# EAGLE design HC-base_revA (EAGLE 7.3.0)
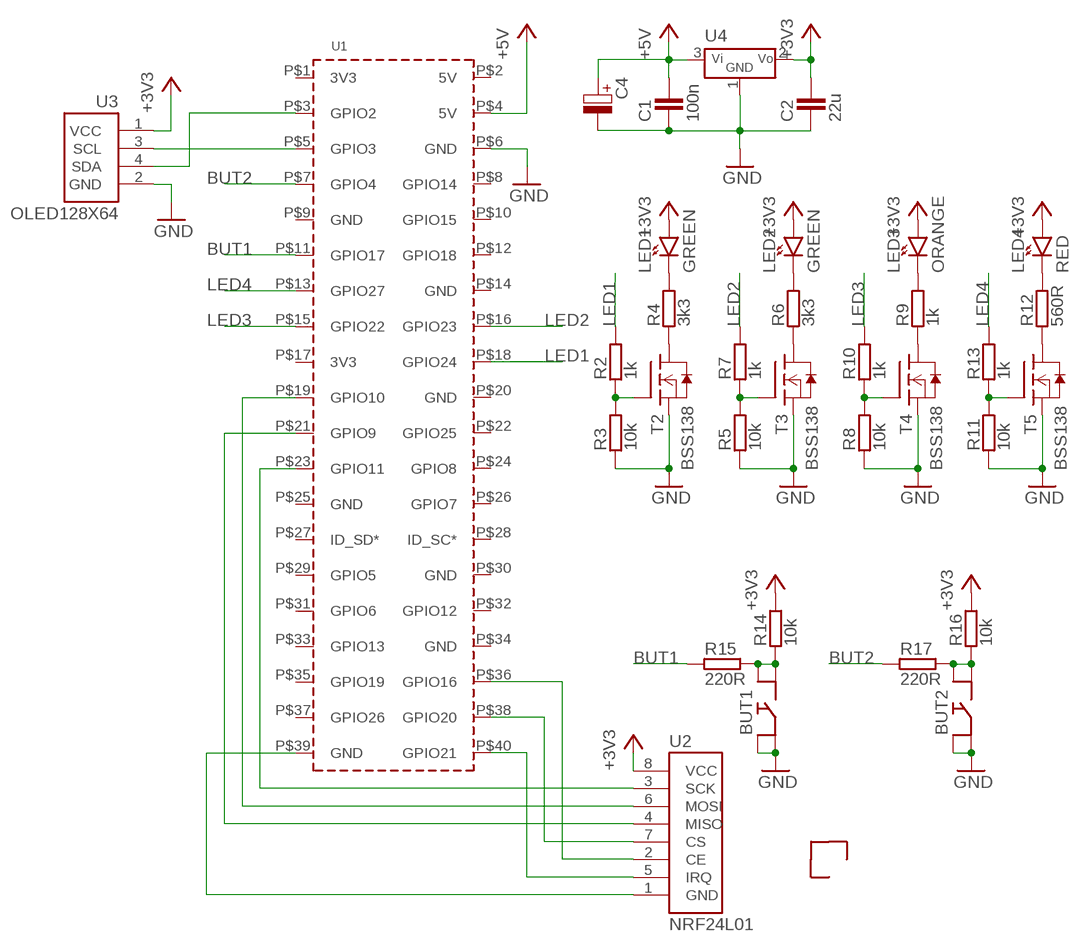
[diagram p0: schematic, sheet 1]

## Parts
BUT1  BUTTON'SMD'  [BUTTON_SMD]
BUT2  BUTTON'SMD'  [BUTTON_SMD]
C1  100n  C-CERAMIC'SMD'  [C0805]
C2  22u  C-CERAMIC'SMD'  [C0805]
C4  C-POLY'6.5MM'  [ELYT-6MM5]
LED1  GREEN  LED'SMD'  [LED0805]
LED2  GREEN  LED'SMD'  [LED0805]
LED3  ORANGE  LED'SMD'  [LED0805]
LED4  RED  LED'SMD'  [LED0805]
R2  1k  R'2'  [R0805]
R3  10k  R'2'  [R0805]
R4  3k3  R'2'  [R0805]
R5  10k  R'2'  [R0805]
R6  3k3  R'2'  [R0805]
R7  1k  R'2'  [R0805]
R8  10k  R'2'  [R0805]
R9  1k  R'2'  [R0805]
R10  1k  R'2'  [R0805]
R11  10k  R'2'  [R0805]
R12  560R  R'2'  [R0805]
R13  1k  R'2'  [R0805]
R14  10k  R'2'  [R0805]
R15  220R  R'2'  [R0805]
R16  10k  R'2'  [R0805]
R17  220R  R'2'  [R0805]
T2  BSS138  [SOT23]
T3  BSS138  [SOT23]
T4  BSS138  [SOT23]
T5  BSS138  [SOT23]
U1  RPI3_SIMPLE'PART'  [RPI3-PART]
U2  NRF24L01  [NRF24L01]
U3  OLED128X64  [OLED128X64]
U4  V_STAB'TS1117'  [SOT223]
U$1  CORNER  [CORNER]
U$2  CORNER  [CORNER]
U$3  CORNER  [CORNER]

## Nets
+3V3: C2.2 LED1.1(A) LED2.1(A) LED3.1(A) LED4.1(A) R14.2 R16.2 U2.8(VCC) U3.1(VCC) U4.2(VOUT)
+5V: C1.2 C4.+(POS) U1.P$4(5V) U4.3(VIN)
BUT1: R15.1 U1.P$11(GPIO17)
BUT2: R17.1 U1.P$7(GPIO4)
GND: BUT1.1 BUT1.2 BUT2.1 BUT2.2 C1.1 C2.1 C4.-(NEG) R3.1 R5.1 R8.1 R11.1 T2.2(S) T3.2(S) T4.2(S) T5.2(S) U1.P$6(GND) U3.2(GND) U4.1(GND)
LED1: R2.2 U1.P$18(GPIO24)
LED2: R7.2 U1.P$16(GPIO23)
LED3: R10.2 U1.P$15(GPIO22)
LED4: R13.2 U1.P$13(GPIO27)
N$1: R2.1 R3.2 T2.1(G)
N$2: U1.P$23(GPIO11) U2.3(SCK)
N$3: U1.P$19(GPIO10) U2.6(MOSI)
N$4: U1.P$21(GPIO9) U2.4(MISO)
N$5: U1.P$38(GPIO20) U2.7(CS)
N$6: U1.P$36(GPIO16) U2.2(CE)
N$7: U1.P$40(GPIO21) U2.5(IRQ)
N$8: U1.P$3(GPIO2) U3.4(SDA)
N$9: U1.P$5(GPIO3) U3.3(SCL)
N$10: R4.1 T2.3(D)
N$11: R6.1 T3.3(D)
N$12: R9.1 T4.3(D)
N$13: R12.1 T5.3(D)
N$14: R5.2 R7.1 T3.1(G)
N$15: LED1.2(K) R4.2
N$16: LED2.2(K) R6.2
N$17: R8.2 R10.1 T4.1(G)
N$18: LED3.2(K) R9.2
N$19: LED4.2(K) R12.2
N$20: R11.2 R13.1 T5.1(G)
N$21: U1.P$39(GND) U2.1(GND)
N$22: BUT1.3 BUT1.4 R14.1 R15.2
N$24: BUT2.3 BUT2.4 R16.1 R17.2
Unconnected: U1.P$1(3V3) U1.P$2(5V) U1.P$8(GPIO14) U1.P$9(GND) U1.P$10(GPIO15) U1.P$12(GPIO18) U1.P$14(GND) U1.P$17(3V3) U1.P$20(GND) U1.P$22(GPIO25) U1.P$24(GPIO8) U1.P$25(GND) U1.P$26(GPIO7) U1.P$27(ID_SD*) U1.P$28(ID_SC*) U1.P$29(GPIO5) U1.P$30(GND) U1.P$31(GPIO6) U1.P$32(GPIO12) U1.P$33(GPIO13) U1.P$34(GND) U1.P$35(GPIO19) U1.P$37(GPIO26)

## Library data of the parts
BUT1 BUT2 = 1_domaci:BUTTON
C1 C2 = 1_domaci:C-CERAMIC
C4 = 1_domaci:C-POLY
LED1-LED4 = 1_domaci:LED
R2-R17 = 1_domaci:R
T2-T5 = 1_domaci:BSS138
U1 = 1_domaci:RPI3_SIMPLE: Device for Raspberry Pi 3 board created by Dave Young for www.element14.com More information and support community is available at https://www.element14.com/community/community/raspberry-pi
U2 = 1_domaci:NRF24L01
U3 = 1_domaci:OLED128X64
U4 = 1_domaci:V_STAB
U$1-U$3 = 1_domaci:CORNER

## Board
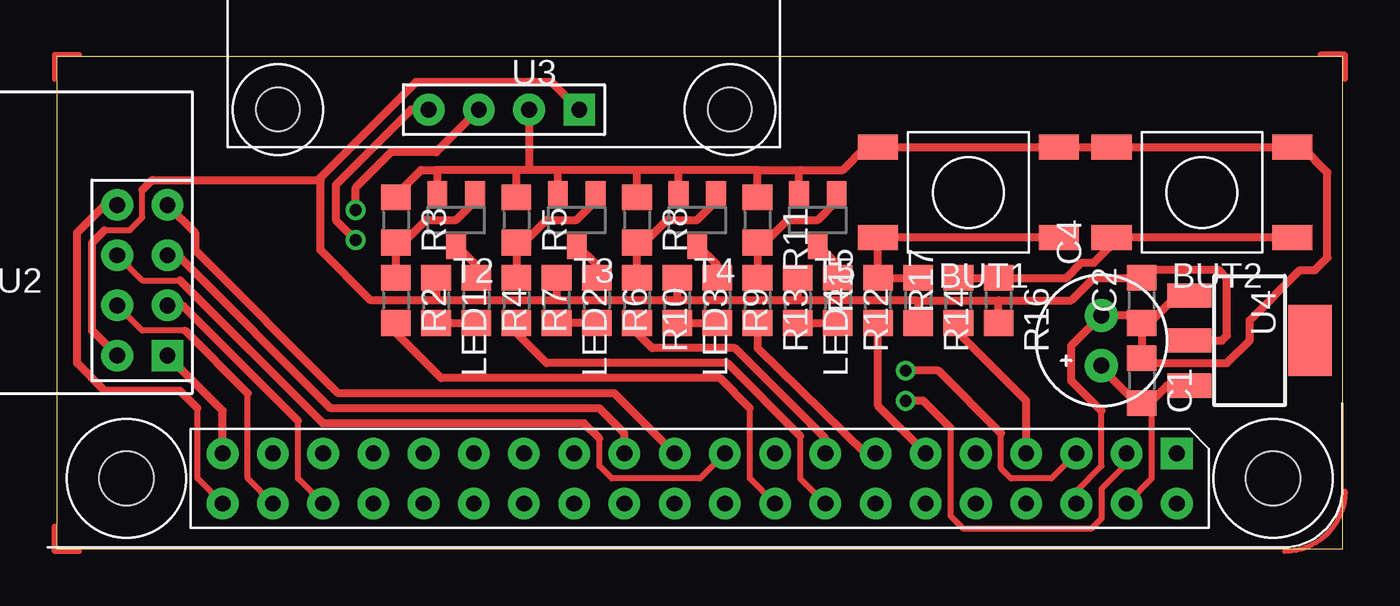
[diagram p1: board, top side]
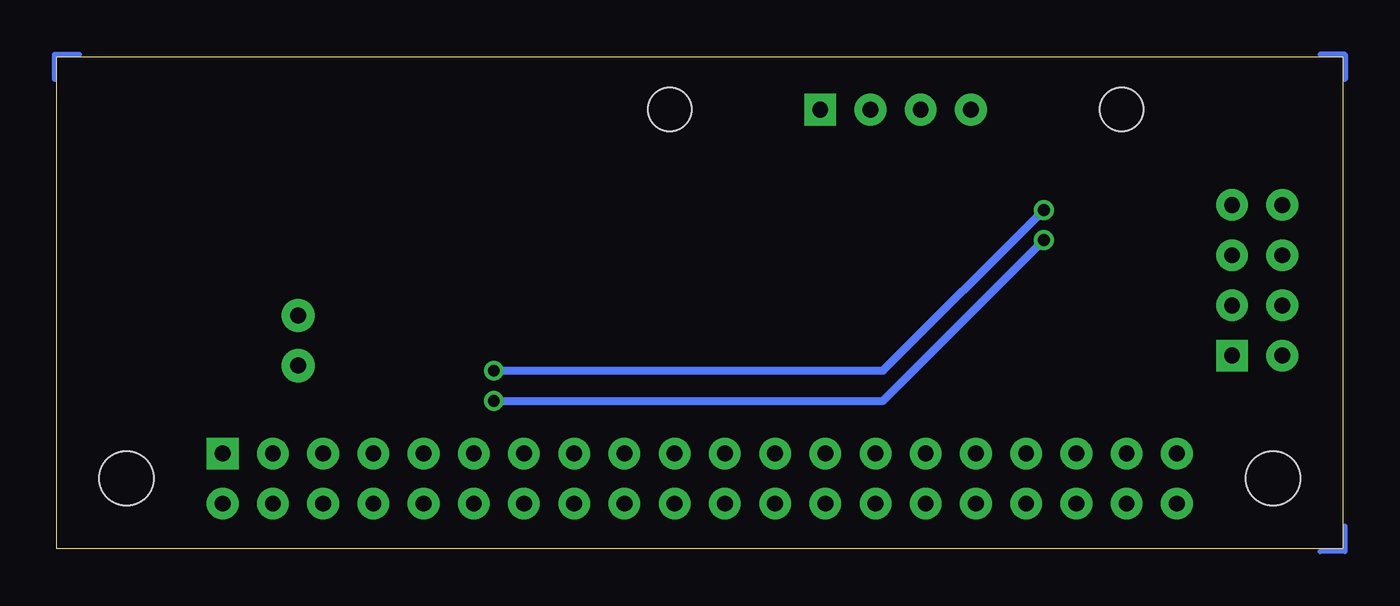
[diagram p2: board, bottom side, seen from below]

Size 65.02 x 24.89 mm. Coordinates in mm from the lower left corner, seen from the top.
Outline: 0,0 65.02,0 65.02,24.89 0,24.89 0,0
Copper layers (1*16): Top 0.035mm / dielectric 1.5mm / Bottom 0.035mm
Design rules "default *": minimum track width 10mil, minimum drill 24mil, track to track 8mil, track to pad 8mil, pad to pad 8mil, via to via 8mil, smd to smd 8mil, copper to edge 40mil, drill to drill 8mil, minimum pad ring 10mil, minimum via ring 8mil, stop-mask expansion 4mil, vias tented up to drill 0mil, thermal gap 10mil

### Footprints (pad centres in the part's own frame; a part is rotated, then mirrored left to right if it is on the bottom)
BUTTON_SMD = smd 2.032 x 1.27: 1 -4.572,-2.286; 2 4.572,-2.286; 3 4.572,2.286; 4 -4.572,2.286
C0805 = smd 1.3 x 1.5: 1 -1.143,0; 2 1.143,0
ELYT-6MM5 = drill 0.813 pad 1.676: + -1.27,0; - 1.27,0
LED0805 = smd 1.3 x 1.5: 1 -1.143,0; 2 1.143,0
R0805 = smd 1.3 x 1.5: 1 -1.143,0; 2 1.143,0
SOT23 = smd 1 x 1.4: 1 -0.953,-1.27; 2 0.953,-1.27; 3 0,1.27
RPI3-PART = drill 0.8 square: P$1 -24.13,-1.27 | drill 0.8: P$2 -24.13,1.27; P$3 -21.59,-1.27; P$4 -21.59,1.27; P$5 -19.05,-1.27; P$6 -19.05,1.27; P$7 -16.51,-1.27; P$8 -16.51,1.27; P$9 -13.97,-1.27; P$10 -13.97,1.27; P$11 -11.43,-1.27; P$12 -11.43,1.27; P$13 -8.89,-1.27; P$14 -8.89,1.27; P$15 -6.35,-1.27; P$16 -6.35,1.27; P$17 -3.81,-1.27; P$18 -3.81,1.27; P$19 -1.27,-1.27; P$20 -1.27,1.27; P$21 1.27,-1.27; P$22 1.27,1.27; P$23 3.81,-1.27; P$24 3.81,1.27; P$25 6.35,-1.27; P$26 6.35,1.27; P$27 8.89,-1.27; P$28 8.89,1.27; P$29 11.43,-1.27; P$30 11.43,1.27; P$31 13.97,-1.27; P$32 13.97,1.27; P$33 16.51,-1.27; P$34 16.51,1.27; P$35 19.05,-1.27; P$36 19.05,1.27; P$37 21.59,-1.27; P$38 21.59,1.27; P$39 24.13,-1.27; P$40 24.13,1.27 | hole 2.75: -28.999,-0.013; 29.001,-0.013
NRF24L01 = drill 0.8 square: 1 -1.27,5.08 | drill 0.8: 2 -1.27,2.54; 3 -1.27,0; 4 -1.27,-2.54; 5 1.27,-2.54; 6 1.27,0; 7 1.27,2.54; 8 1.27,5.08
OLED128X64 = drill 0.8 square: 1 -3.81,0 | drill 0.8: 2 -1.27,0; 3 1.27,0; 4 3.81,0 | hole 2.2: -11.43,0; 11.43,0
SOT223 = smd 1.219 x 2.235: 1 -2.286,-3.048; 2 0,-3.048; 3 2.286,-3.048 | smd 3.6 x 2.2: 4 0,3.048

### Placement (x,y rotation side)
BUT1  46.1,18.03 180 top
BUT2  57.91,18.03 180 top
C1  54.86,8.51 270 top
C2  54.86,12.57 90 top
C4  52.83,10.54 90 top
LED1  19.18,12.57 270 top
LED2  25.27,12.57 270 top
LED3  31.37,12.57 270 top
LED4  37.47,12.57 270 top
R2  17.14,12.57 270 top
R3  17.14,16.64 270 top
R4  21.21,12.57 270 top
R5  23.24,16.64 270 top
R6  27.31,12.57 270 top
R7  23.24,12.57 270 top
R8  29.34,16.64 270 top
R9  33.4,12.57 270 top
R10  29.34,12.57 270 top
R11  35.43,16.64 270 top
R12  39.5,12.57 270 top
R13  35.43,12.57 270 top
R14  43.56,12.57 270 top
R15  41.53,12.57 90 top
R16  47.62,12.57 270 top
R17  45.59,12.57 90 top
T2  20.19,16.64 180 top
T3  26.29,16.64 180 top
T4  32.39,16.64 180 top
T5  38.48,16.64 180 top
U1  32.51,3.56 180 top
U2  4.32,14.86 180 top
U3  22.61,22.22 180 top
U4  60.33,10.54 270 top
U$1  0.51,0.51 0 top
U$2  64.52,24.38 180 top
U$3  0.51,24.38 270 top

### Tracks (layer width: path | path; a pad name or v marks a point on that pad's centre or on a via)
+3V3
  Top 0.305: 2.41,16.13 3.68,16.13 4.32,16.76 4.32,18.16
  Top 0.406: U4.2 58.93,10.54 59.18,10.79 59.18,13.72 58.8,14.1 55.25,14.1 C2.2 52.45,13.72 51.31,12.57 47.62,12.57 | 43.43,12.57 47.62,12.57 | R16.2 47.62,12.57 | R14.2 43.56,12.45 43.43,12.57 | U2.8 1.78,11.05 1.78,15.49 2.41,16.13 | 4.32,18.16 4.83,18.67 13.34,18.67 | 43.43,12.57 37.47,12.57 | 37.47,12.57 31.37,12.57 | 31.37,12.57 25.27,12.57 | 25.27,12.57 19.18,12.57 | LED4.1 37.47,12.57 | LED3.1 31.37,12.57 | LED2.1 25.27,12.57 | LED1.1 19.18,12.57 | U3.1 25.02,23.62 18.16,23.62 13.34,18.8 13.34,18.67 | 19.18,12.57 15.88,12.57 13.34,15.11 13.34,18.67
+5V
  Top 0.305: U1.P$4 55.37,3.56 55.37,6.86
  Top 0.406: C1.2 55.25,7.37 56.13,8.25 U4.3 | C1.2 54.61,7.37 52.83,9.14 C4.+ | 55.37,6.86 C1.2
BUT1
  Top 0.406: U1.P$11 41.53,7.24 R15.1
BUT2
  Top 0.406: U1.P$7 49.02,7.49 45.59,10.92 R17.1
GND
  Top 0.305: U1.P$6 51.56,2.92 52.83,4.19 52.83,6.98
  Top 0.406: C2.1 55.25,11.43 56.64,12.83 U4.1 | C2.1 C1.1 55.25,9.65 55.5,9.4 59.18,9.4 60.33,10.54 60.33,11.56 62.86,14.1 63.63,14.1 64.26,14.73 64.26,19.05 62.99,20.32 BUT2.1 BUT2.2 BUT1.1 BUT1.2 40.89,20.32 39.75,19.18 37.59,19.18 | C2.1 54.48,11.81 C4.- 51.31,10.29 51.31,8.51 52.83,6.98 | R11.1 35.43,19.18 | 35.43,19.18 37.59,19.18 | 35.43,19.18 31.37,19.18 | 31.37,19.18 29.34,19.18 | 29.34,19.18 25.4,19.18 | 25.4,19.18 23.88,19.18 | 23.88,19.18 23.24,19.18 | 23.24,19.18 19.18,19.18 | T2.2 19.24,19.11 19.18,19.18 | R5.1 23.24,19.18 | T3.2 25.34,19.11 25.4,19.18 | R8.1 29.34,19.18 | T4.2 31.43,19.11 31.37,19.18 | T5.2 37.53,19.11 37.59,19.18 | U3.2 23.88,19.18 | R3.1 17.14,17.91 18.41,19.18 19.18,19.18
LED1
  Top 0.305: 35.05,7.11 35.05,3.56 U1.P$18
  Top 0.406: 35.05,7.11 33.53,8.64 19.43,8.64 17.14,10.92 R2.2
LED2
  Top 0.305: 37.59,5.71 37.59,3.56 U1.P$16
  Top 0.406: 37.59,5.71 33.91,9.4 24.77,9.4 23.24,10.92 R7.2
LED3
  Top 0.406: R10.2 29.34,10.92 30.1,10.16 34.29,10.16 38.86,5.59 U1.P$15
LED4
  Top 0.406: R13.2 35.43,10.16 40.89,4.83 U1.P$13
N$1
  Top 0.406: T2.1 21.14,17.59 20.19,16.64 18.67,16.64 17.53,15.49 R3.2 R2.1
N$2
  Top 0.406: U1.P$23 28.7,5.84 27.43,7.11 13.84,7.11 6.1,14.86 U2.3
N$3
  Top 0.305: U1.P$19 32.51,3.56 28.07,3.56 27.43,4.19 27.43,5.59 | U2.6 4.32,13.59 6.22,13.59
  Top 0.406: 27.43,5.59 26.67,6.35 13.46,6.35 6.22,13.59
N$4
  Top 0.406: U1.P$21 28.19,7.87 14.22,7.87 6.98,15.11 6.98,16 U2.4
N$5
  Top 0.305: U1.P$38 9.65,3.56 9.65,7.87 | U2.7 4.32,11.05 6.48,11.05
  Top 0.406: 9.65,7.87 6.48,11.05
N$6
  Top 0.305: U1.P$36 12.19,3.56 12.19,6.48
  Top 0.406: 12.19,6.48 6.35,12.32 U2.2
N$7
  Top 0.305: U1.P$40 7.11,3.56 7.11,7.11
  Top 0.406: 7.11,7.11 6.22,8 2.41,8 1.02,9.4 1.02,16 2.41,17.4 U2.5
N$8  (via drill 0.6)
  Top 0.305: U1.P$3 54.1,4.32 52.83,3.05 52.83,1.52 52.32,1.02 45.85,1.02 45.21,1.65 45.21,6.1
  Top 0.406: 45.21,6.1 43.81,7.49 v42.93,7.49 | U3.4 17.91,22.22 14.1,18.42 14.1,16.64 v15.11,15.62
  Bottom 0.406: v42.93,7.49 23.24,7.49 v15.11,15.62
N$9  (via drill 0.6)
  Top 0.305: U1.P$5 50.29,3.56 48.26,3.56 47.75,4.06 47.75,5.84
  Top 0.406: 47.75,5.84 44.58,9.02 v42.93,9.02 | v15.11,17.14 15.11,18.29 16.89,20.07 19.18,20.07 U3.3
  Bottom 0.406: v42.93,9.02 23.24,9.02 v15.11,17.14
N$10
  Top 0.406: R4.1 21.21,14.35 T2.3
N$11
  Top 0.406: R6.1 27.31,14.35 T3.3
N$12
  Top 0.406: R9.1 33.4,14.35 T4.3
N$13
  Top 0.406: R12.1 39.5,14.35 T5.3
N$14
  Top 0.406: T3.1 27.24,17.59 26.29,16.64 24.77,16.64 23.62,15.49 R5.2 R7.1
N$15
  Top 0.406: LED1.2 R4.2
N$16
  Top 0.406: R6.2 LED2.2
N$17
  Top 0.406: T4.1 33.34,17.59 32.39,16.64 30.86,16.64 29.72,15.49 R8.2 R10.1
N$18
  Top 0.406: LED3.2 R9.2
N$19
  Top 0.406: LED4.2 R12.2
N$20
  Top 0.406: T5.1 39.43,17.59 38.48,16.64 36.96,16.64 35.81,15.49 R11.2 R13.1
N$21
  Top 0.406: U1.P$39 8.38,6.98 U2.1
N$22
  Top 0.406: BUT1.4 BUT1.3 R15.2 R14.1
N$24
  Top 0.406: BUT2.4 BUT2.3 53.21,15.62 53.21,15.24 52.45,14.48 51.82,14.48 51.05,13.72 R16.1 R17.2
N$25
  Top 0.254: 65.15,2.92 arc-90 62.1,-0.13